# EAGLE design SO2Rduino-V1 (EAGLE 5.10)

## Sheet 1 of 2
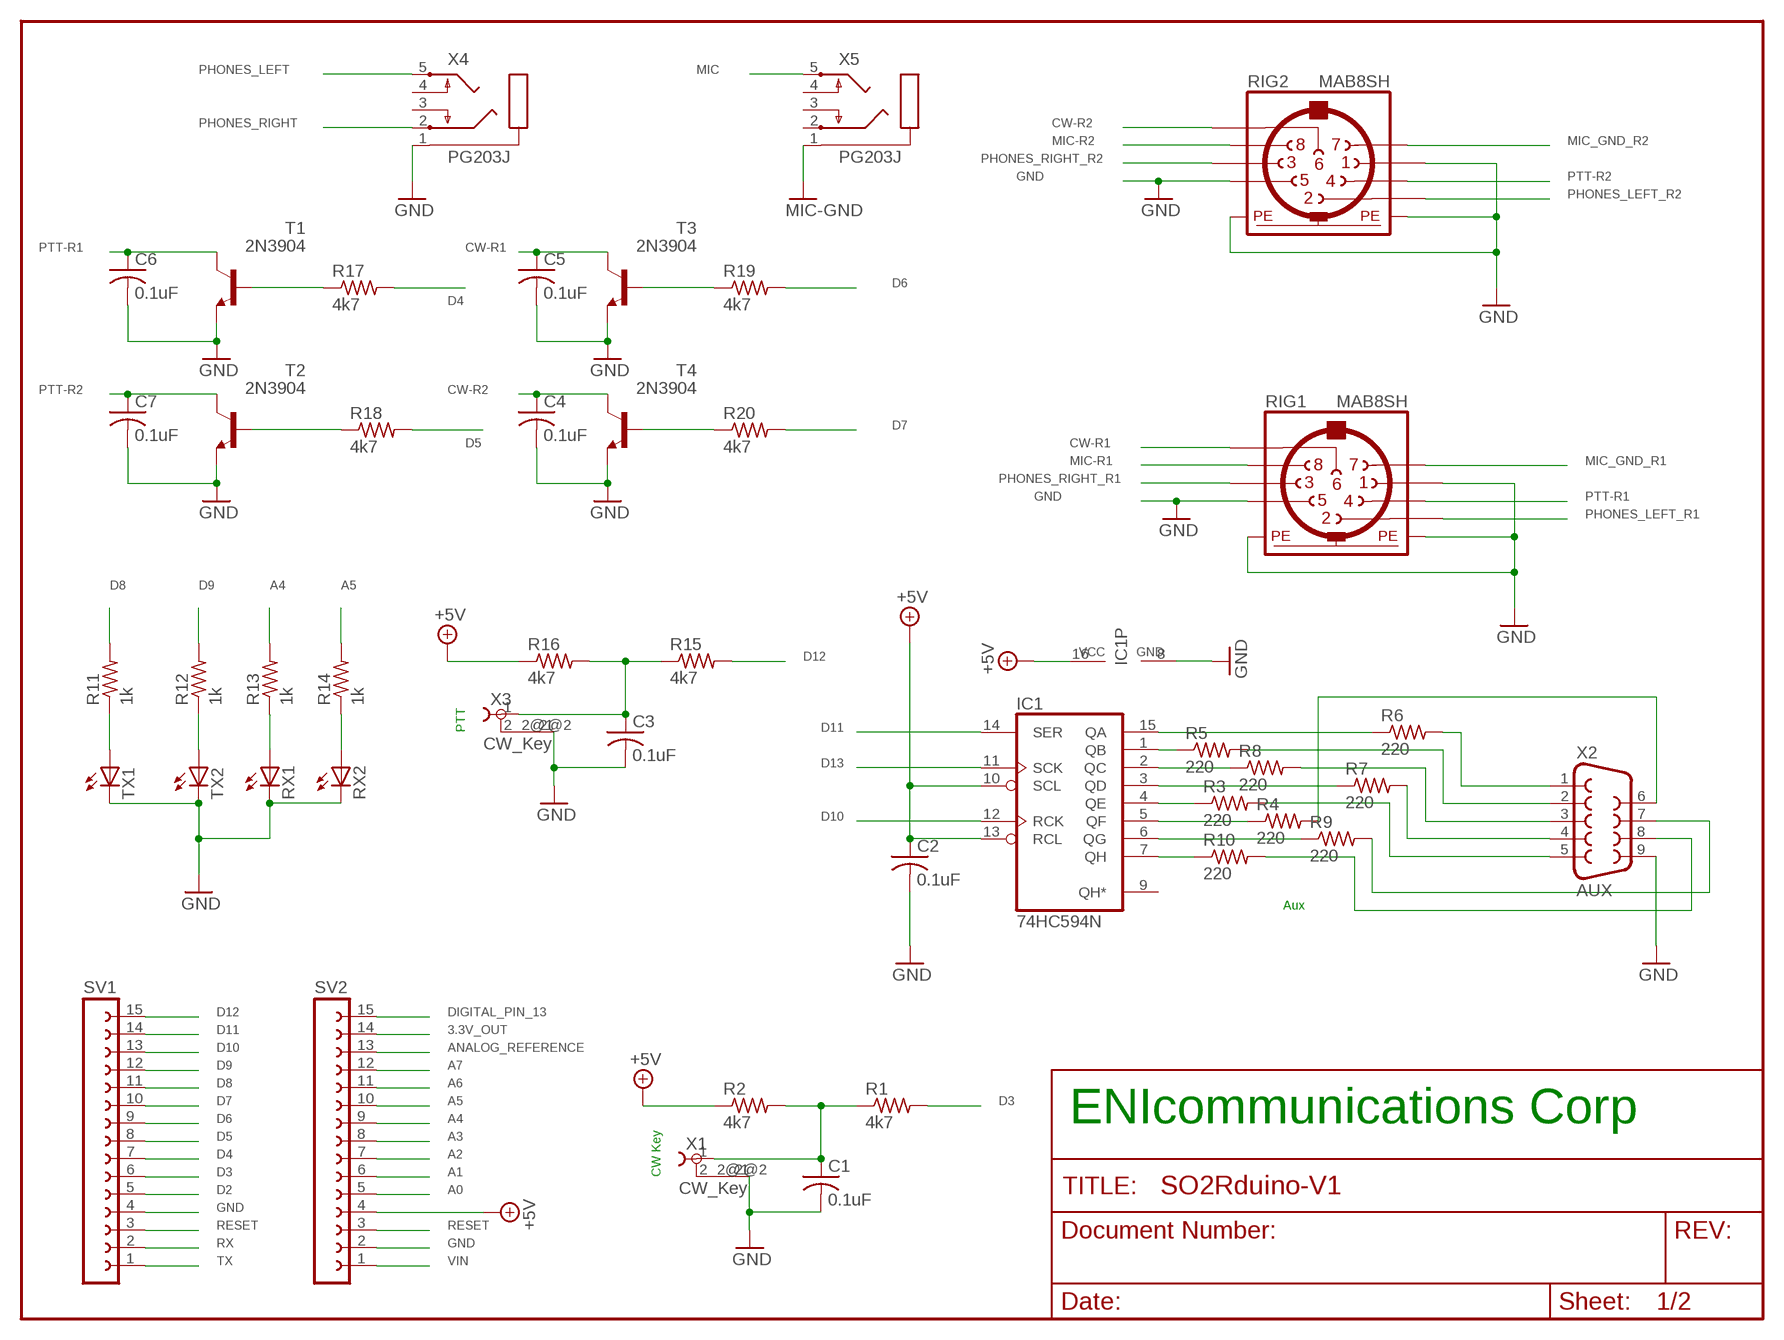
[diagram p0: schematic, sheet 1]

### Parts
C1  0.1uF  C-US025-025X050  [C025-025X050]
C2  0.1uF  C-US025-025X050  [C025-025X050]
C3  0.1uF  C-US025-025X050  [C025-025X050]
C4  0.1uF  C-US025-025X050  [C025-025X050]
C5  0.1uF  C-US025-025X050  [C025-025X050]
C6  0.1uF  C-US025-025X050  [C025-025X050]
C7  0.1uF  C-US025-025X050  [C025-025X050]
IC1  74HC594N  [DIL16]
R1  4k7  R-US_0204/7  [0204/7]
R2  4k7  R-US_0204/7  [0204/7]
R3  220  R-US_0204/7  [0204/7]
R4  220  R-US_0204/7  [0204/7]
R5  220  R-US_0204/7  [0204/7]
R6  220  R-US_0204/7  [0204/7]
R7  220  R-US_0204/7  [0204/7]
R8  220  R-US_0204/7  [0204/7]
R9  220  R-US_0204/7  [0204/7]
R10  220  R-US_0204/7  [0204/7]
R11  1k  R-US_0204/7  [0204/7]
R12  1k  R-US_0204/7  [0204/7]
R13  1k  R-US_0204/7  [0204/7]
R14  1k  R-US_0204/7  [0204/7]
R15  4k7  R-US_0204/7  [0204/7]
R16  4k7  R-US_0204/7  [0204/7]
R17  4k7  R-US_0204/7  [0204/7]
R18  4k7  R-US_0204/7  [0204/7]
R19  4k7  R-US_0204/7  [0204/7]
R20  4k7  R-US_0204/7  [0204/7]
RIG1  MAB8SH  [MAB8SH]
RIG2  MAB8SH  [MAB8SH]
RX1  LED5MM  [LED5MM]
RX2  LED5MM  [LED5MM]
SV1  FE15-1  [FE15]
SV2  FE15-1  [FE15]
T1  2N3904  [TO92]
T2  2N3904  [TO92]
T3  2N3904  [TO92]
T4  2N3904  [TO92]
TX1  LED5MM  [LED5MM]
TX2  LED5MM  [LED5MM]
X1  CW_Key  TOBU3  [TOBU3]
X2  AUX  DB9  [DB9]
X3  CW_Key  TOBU3  [TOBU3]
X4  PG203J  [PG203J]
X5  PG203J  [PG203J]

### Nets
3.3V_OUT: SV2.14
+5V: C2.1 IC1.10(SCL) IC1.13(RCL) IC1.16(VCC) R2.1 R16.1 SV2.4 ; also sheet 2
A0: SV2.5 ; also sheet 2
A1: SV2.6 ; also sheet 2
A2: SV2.7 ; also sheet 2
A3: SV2.8 ; also sheet 2
A4: R13.2 SV2.9
A5: R14.2 SV2.10
A6: SV2.11
A7: SV2.12
ANALOG_REFERENCE: SV2.13
CW-R1: C5.1 RIG1.6 T3.1(C)
CW-R2: C4.1 RIG2.6 T4.1(C)
D2: SV1.5
D3: R1.2 SV1.6
D4: R17.2 SV1.7
D5: R18.2 SV1.8
D6: R19.2 SV1.9
D7: R20.2 SV1.10
D8: R11.2 SV1.11
D9: R12.2 SV1.12 ; also sheet 2
D10: IC1.12(RCK) SV1.13
D11: IC1.14(SER) SV1.14 ; also sheet 2
D12: R15.2 SV1.15
D13: IC1.11(SCK) ; also sheet 2
DIGITAL_PIN_13: SV2.15
GND: C1.2 C2.2 C3.2 C4.2 C5.2 C6.2 C7.2 IC1.8(GND) RIG1.1 RIG1.5 RIG1.PE RIG1.PE@(PE) RIG2.1 RIG2.5 RIG2.PE RIG2.PE@(PE) RX1.K(C) RX2.K(C) SV1.4 SV2.2 T1.3(E) T2.3(E) T3.3(E) T4.3(E) TX1.K(C) TX2.K(C) X1.2@2 X2.9 X3.2@2 X4.1 ; also sheet 2
MIC: X5.5 ; also sheet 2
MIC-GND: X5.1 ; also sheet 2
MIC-R1: RIG1.8 ; also sheet 2
MIC-R2: RIG2.8 ; also sheet 2
MIC_GND_R1: RIG1.7 ; also sheet 2
MIC_GND_R2: RIG2.7 ; also sheet 2
N$1: C1.1 R1.1 R2.2 X1.1
N$2: IC1.4(QE) R3.1
N$3: R3.2 X2.5
N$4: IC1.3(QD) R7.1
N$5: R7.2 X2.4
N$6: IC1.2(QC) R8.1
N$7: R8.2 X2.3
N$8: IC1.1(QB) R5.1
N$9: R5.2 X2.2
N$10: IC1.15(QA) R6.1
N$11: R6.2 X2.1
N$12: IC1.5(QF) R4.1
N$13: R4.2 X2.6
N$14: IC1.6(QG) R9.1
N$15: IC1.7(QH) R10.1
N$16: R9.2 X2.7
N$17: R10.2 X2.8
N$18: R12.1 TX2.A
N$19: R11.1 TX1.A
N$20: C3.1 R15.1 R16.2 X3.1
N$21: R13.1 RX1.A
N$22: R14.1 RX2.A
N$23: R17.1 T1.2(B)
N$24: R18.1 T2.2(B)
N$25: R19.1 T3.2(B)
N$26: R20.1 T4.2(B)
PHONES_LEFT: X4.5 ; also sheet 2
PHONES_LEFT_R1: RIG1.2 ; also sheet 2
PHONES_LEFT_R2: RIG2.2 ; also sheet 2
PHONES_RIGHT: X4.2 ; also sheet 2
PHONES_RIGHT_R1: RIG1.3 ; also sheet 2
PHONES_RIGHT_R2: RIG2.3 ; also sheet 2
PTT-R1: C6.1 RIG1.4 T1.1(C)
PTT-R2: C7.1 RIG2.4 T2.1(C)
RESET: SV1.3 SV2.3
RX: SV1.2
TX: SV1.1
VIN: SV2.1
Unconnected: IC1.9(QH*) X1.2 X1.2@1 X3.2 X3.2@1 X4.3 X4.4 X5.2 X5.3 X5.4

### Notes on the sheet
- PTT
- Aux
- ENIcommunications Corp
- CW Key

## Sheet 2 of 2
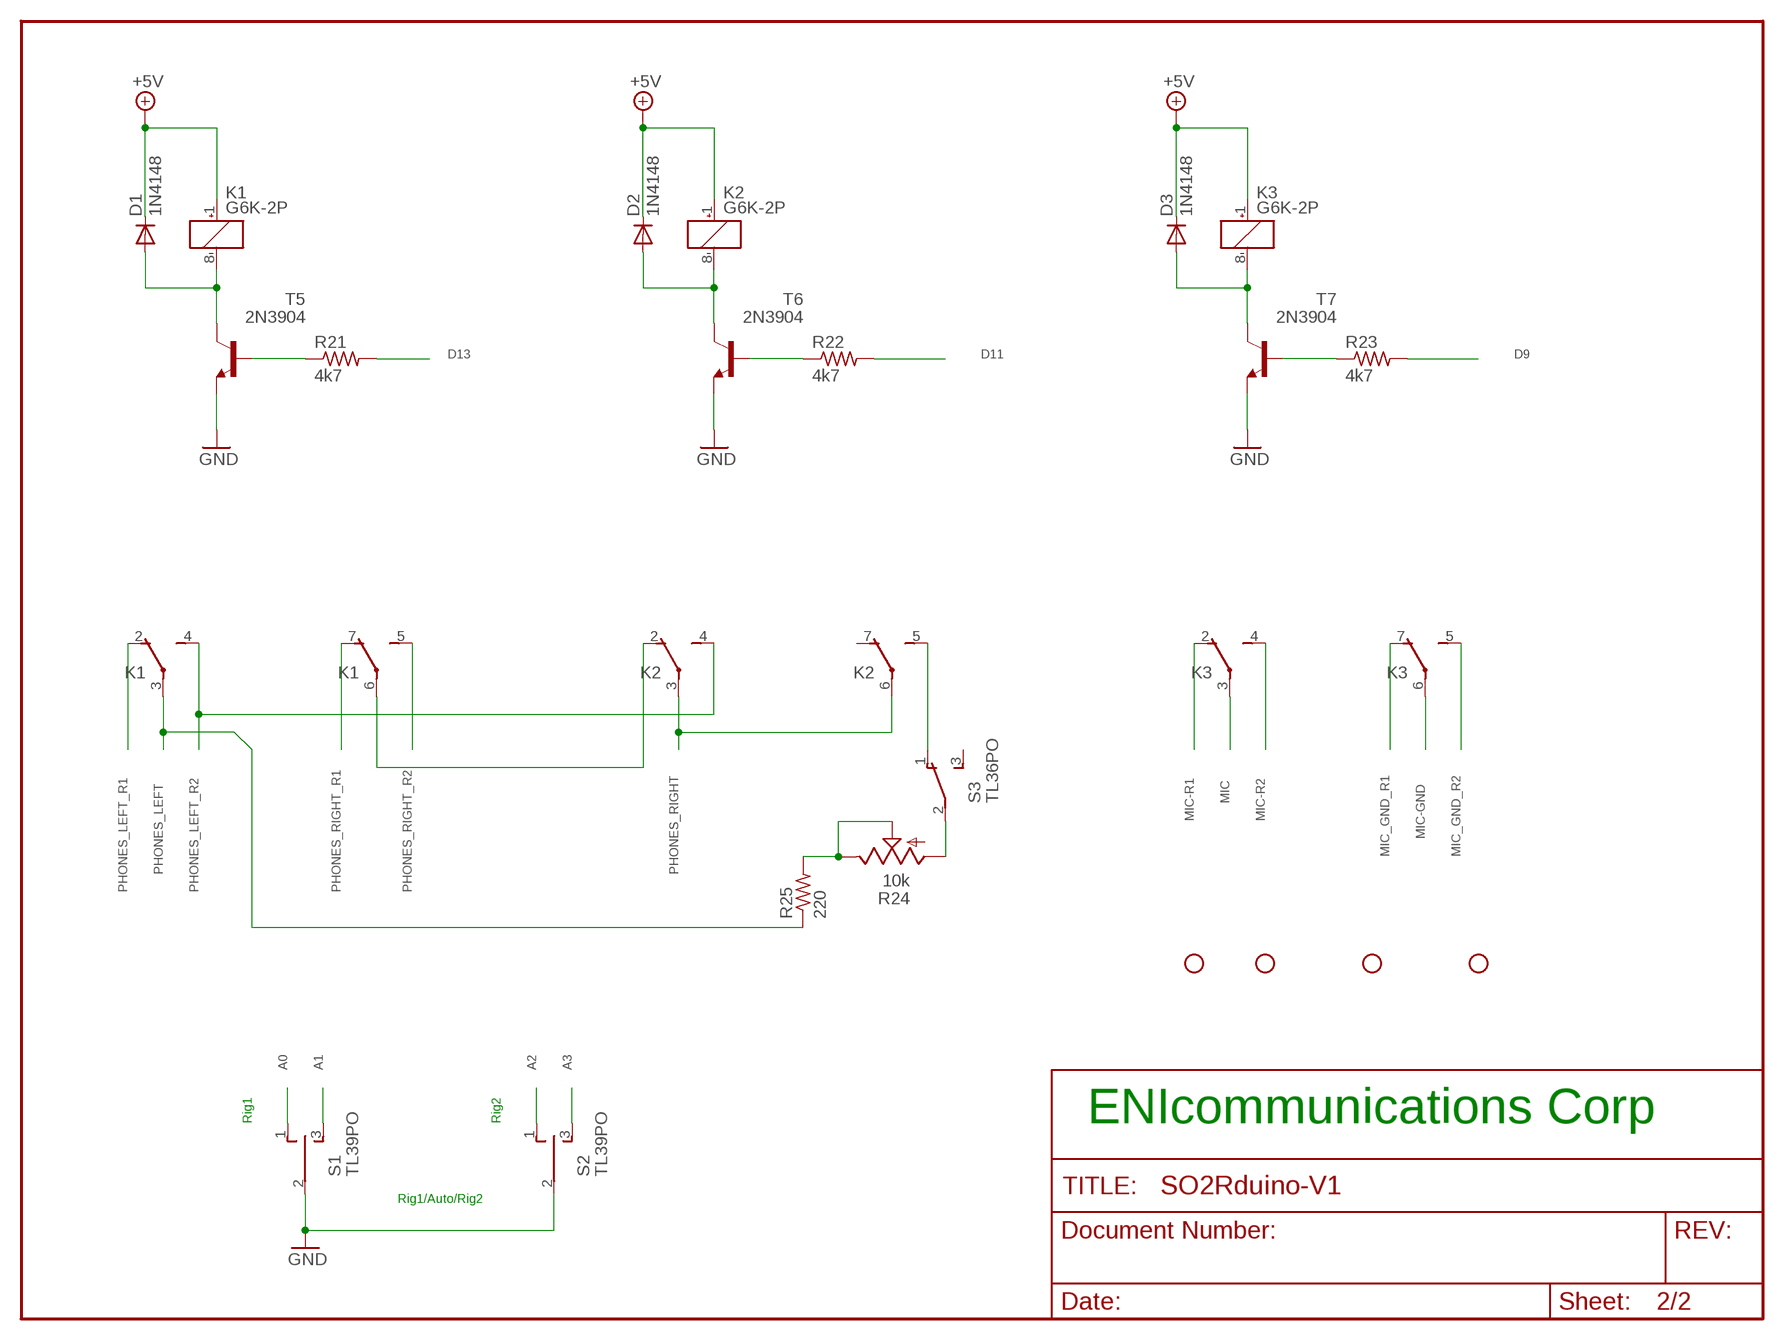
[diagram p1: schematic, sheet 2]

### Parts
D1  1N4148  [DO35-10]
D2  1N4148  [DO35-10]
D3  1N4148  [DO35-10]
JP1  STAND-OFF  [STAND-OFF]
JP2  STAND-OFF  [STAND-OFF]
JP3  STAND-OFF  [STAND-OFF]
JP6  STAND-OFF  [STAND-OFF]
K1  G6K-2P  [G6K-2P]
K2  G6K-2P  [G6K-2P]
K3  G6K-2P  [G6K-2P]
R21  4k7  R-US_0204/7  [0204/7]
R22  4k7  R-US_0204/7  [0204/7]
R23  4k7  R-US_0204/7  [0204/7]
R24  10k  TRIM_US-CA6V  [CA6V]
R25  220  R-US_0204/7  [0204/7]
S1  TL39PO  [TL3XPO]
S2  TL39PO  [TL3XPO]
S3  TL36PO  [TL3XPO]
T5  2N3904  [TO92]
T6  2N3904  [TO92]
T7  2N3904  [TO92]

### Nets
+5V: D1.C D2.C D3.C K1.1(1:+) K2.1(1:+) K3.1(1:+) ; also sheet 1
A0: S1.1(O) ; also sheet 1
A1: S1.3(S) ; also sheet 1
A2: S2.1(O) ; also sheet 1
A3: S2.3(S) ; also sheet 1
D9: R23.2 ; also sheet 1
D11: R22.2 ; also sheet 1
D13: R21.2 ; also sheet 1
GND: S1.2(P) S2.2(P) T5.3(E) T6.3(E) T7.3(E) ; also sheet 1
MIC: K3.3(2:P) ; also sheet 1
MIC-GND: K3.6(3:P) ; also sheet 1
MIC-R1: K3.2(2:O) ; also sheet 1
MIC-R2: K3.4(2:S) ; also sheet 1
MIC_GND_R1: K3.7(3:O) ; also sheet 1
MIC_GND_R2: K3.5(3:S) ; also sheet 1
N$27: D2.A K2.8(1:-) T6.1(C)
N$28: D3.A K3.8(1:-) T7.1(C)
N$29: K2.5(3:S) S3.1(O)
N$30: R24.A S3.2(P)
N$31: R22.1 T6.2(B)
N$32: D1.A K1.8(1:-) T5.1(C)
N$33: R21.1 T5.2(B)
N$34: R23.1 T7.2(B)
N$37: R24.E R24.S R25.2
N$40: K1.6(3:P) K2.2(2:O)
PHONES_LEFT: K1.3(2:P) R25.1 ; also sheet 1
PHONES_LEFT_R1: K1.2(2:O) ; also sheet 1
PHONES_LEFT_R2: K1.4(2:S) K2.4(2:S) ; also sheet 1
PHONES_RIGHT: K2.3(2:P) K2.6(3:P) ; also sheet 1
PHONES_RIGHT_R1: K1.7(3:O) ; also sheet 1
PHONES_RIGHT_R2: K1.5(3:S) ; also sheet 1
Unconnected: K2.7(3:O) S3.3(S)

### Notes on the sheet
- Rig1 | Rig2 | ENIcommunications Corp
- Rig1/Auto/Rig2

## Library data of the parts
C1-C7 = rcl:C-US: CAPACITOR, American symbol
D1-D3 = diode:1N4148: DIODE high speed (Philips)
IC1 = 74xx-eu:74*594: 8-bit SHIFT REGISTER, output latch
JP1-JP3 JP6 = SparkFun:STAND-OFF: Stand Off This is the mechanical footprint for a #4 phillips button head screw. Use the keepout ring to avoid running the screw head into surrounding components. SKU : PRT-00447
K1-K3 = relay:G6K: Low Signal Relay oeiwcsnts1.omron.com/.. D20G6K0100.pdf
R1-R23 R25 = resistor:R-US_: RESISTOR, American symbol
R24 = pot:TRIM_US-: POTENTIOMETER
RIG1 RIG2 = con-hirschmann:MAB8SH: Female CONNECTOR 8 pins with shield, horizontal (DIN 41524)
RX1 RX2 TX1 TX2 = led:LED: LED OSRAM: - CHIPLED LG R971, LG N971, LY N971, LG Q971, LY Q971, LO R971, LY R971 LH N974, LH R974 LS Q976, LO Q976, LY Q976 LO Q996 - Hyper CHIPLED LW Q18S LB Q993, LB Q99A, LB R99A - SideLED LS A670, LO A670, LY A670, LG A670, LP A670 LB A673, LV A673, LT A673, LW A673 LH A674 LY A675 LS A676, LA A676, LO A676, LY A676, LW A676 LS A679, LY A679, LG A679 - Hyper Micro SIDELED® LS Y876, LA Y876, LO Y876, LY Y876 LT Y87S - SmartLED LW L88C, LW L88S LB L89C, LB L89S, LG L890 LS L89K, LO L89K, LY L89K LS L896, LA L896, LO L896, LY L896 - TOPLED LS T670, LO T670, LY T670, LG T670, LP T670 LSG T670, LSP T670, LSY T670, LOP T670, LYG T670 LG T671, LOG T671, LSG T671 LB T673, LV T673, LT T673, LW T673 LH T674 LS T676, LA T676, LO T676, LY T676, LB T676, LH T676, LSB T676, LW T676 LB T67C, LV T67C, LT T67C, LS T67K, LO T67K, LY T67K, LW E67C LS E67B, LA E67B, LO E67B, LY E67B, LB E67C, LV E67C, LT E67C LW T67C LS T679, LY T679, LG T679 LS T770, LO T770, LY T770, LG T770, LP T770 LB T773, LV T773, LT T773, LW T773 LH T774 LS E675, LA E675, LY E675, LS T675 LS T776, LA T776, LO T776, LY T776, LB T776 LHGB T686 LT T68C, LB T68C - Hyper Mini TOPLED® LB M676 - Mini TOPLED Santana® LG M470 LS M47K, LO M47K, LY M47K Source: http://www.osram.convergy.de/
S1 S2 = switch:TL39PO: TINY SWITCH ON OFF ON Source: http://www2.produktinfo.conrad.com/datenblaetter/700000-724999/705152-da-01-de-Subminiaturschalter_TL_36YO.pdf
S3 = switch:TL36PO: TINY SWITCH ON - ON Source: http://www2.produktinfo.conrad.com/datenblaetter/700000-724999/705152-da-01-de-Subminiaturschalter_TL_36YO.pdf
SV1 SV2 = con-lsta:FE15-1: FEMALE HEADER
T1-T7 = transistor:2N3904: NPN TRANSISTOR
X1 X3 = con-hirschmann:TOBU3: Female Cinch CONNECTOR ( RCA Jack )
X2 = SparkFun:DB9: DB9 Connector Standard DB9 (D-Sub 9) serial connector. Can be used for CAN bus as well as RS485 and RS232. Footprint production proven. Spark Fun Electronics SKU : PRT-00429
X4 X5 = con-hirschmann:PG203J: MIC/HEADPHONE JACK KS-S stereo microphone/headphone jack PG203JN (Schukat)

## Board
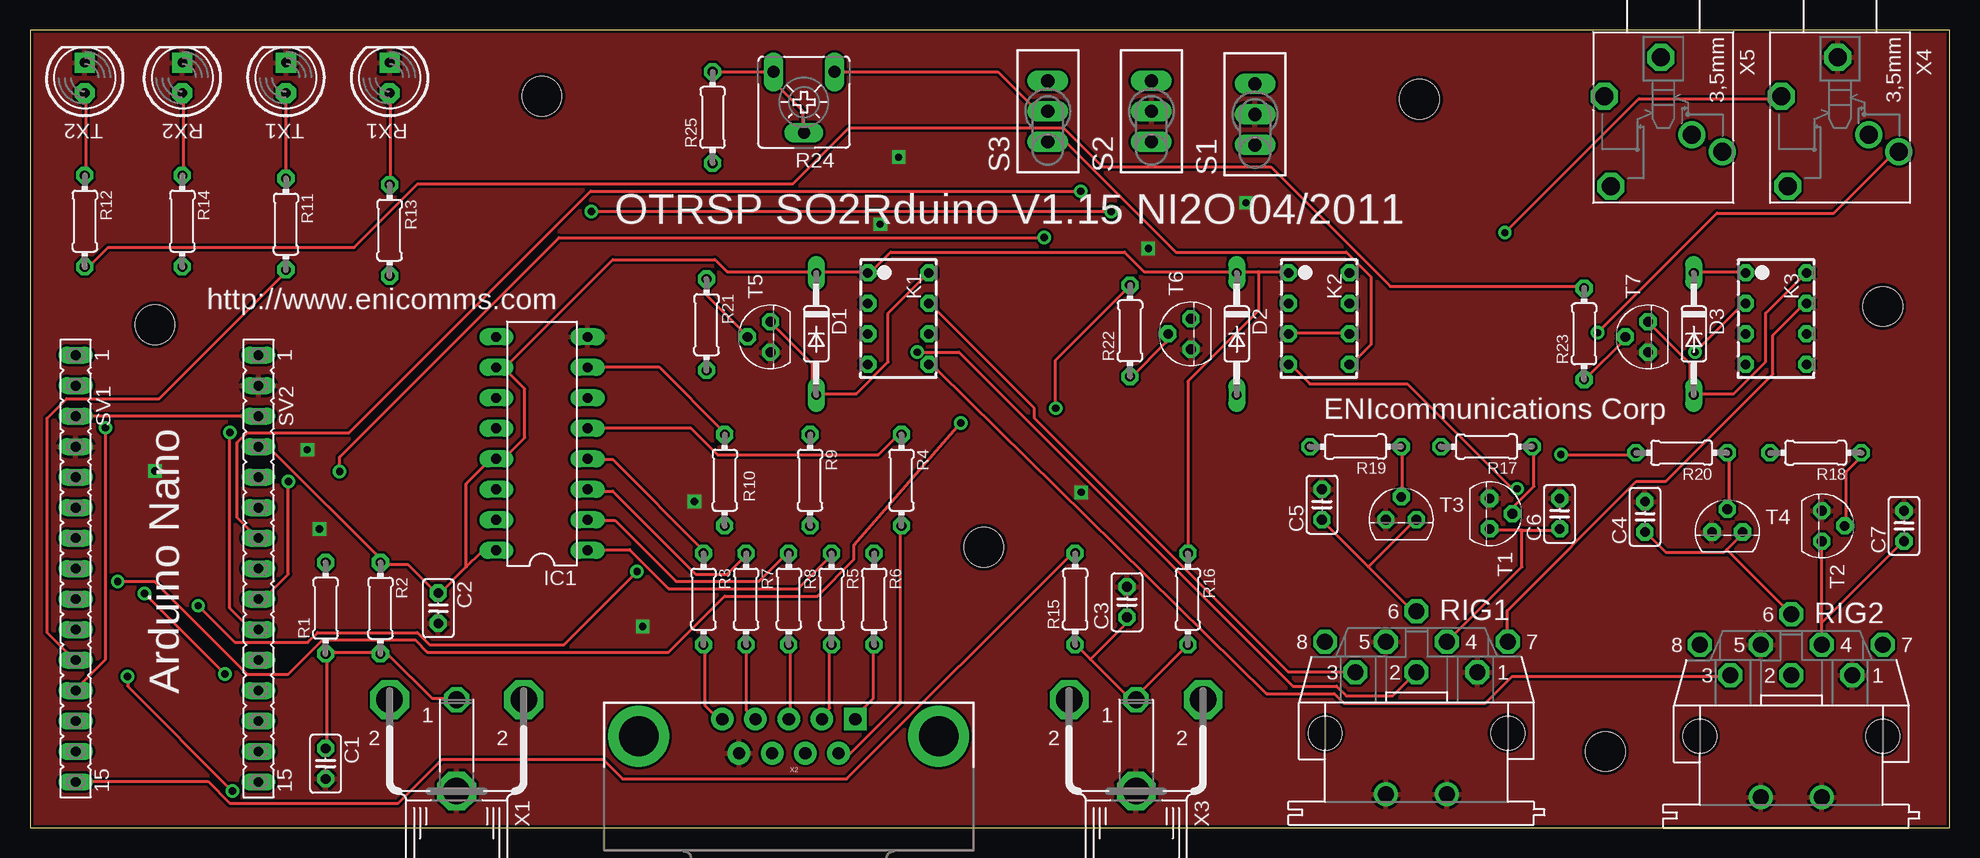
[diagram p2: board, top side]
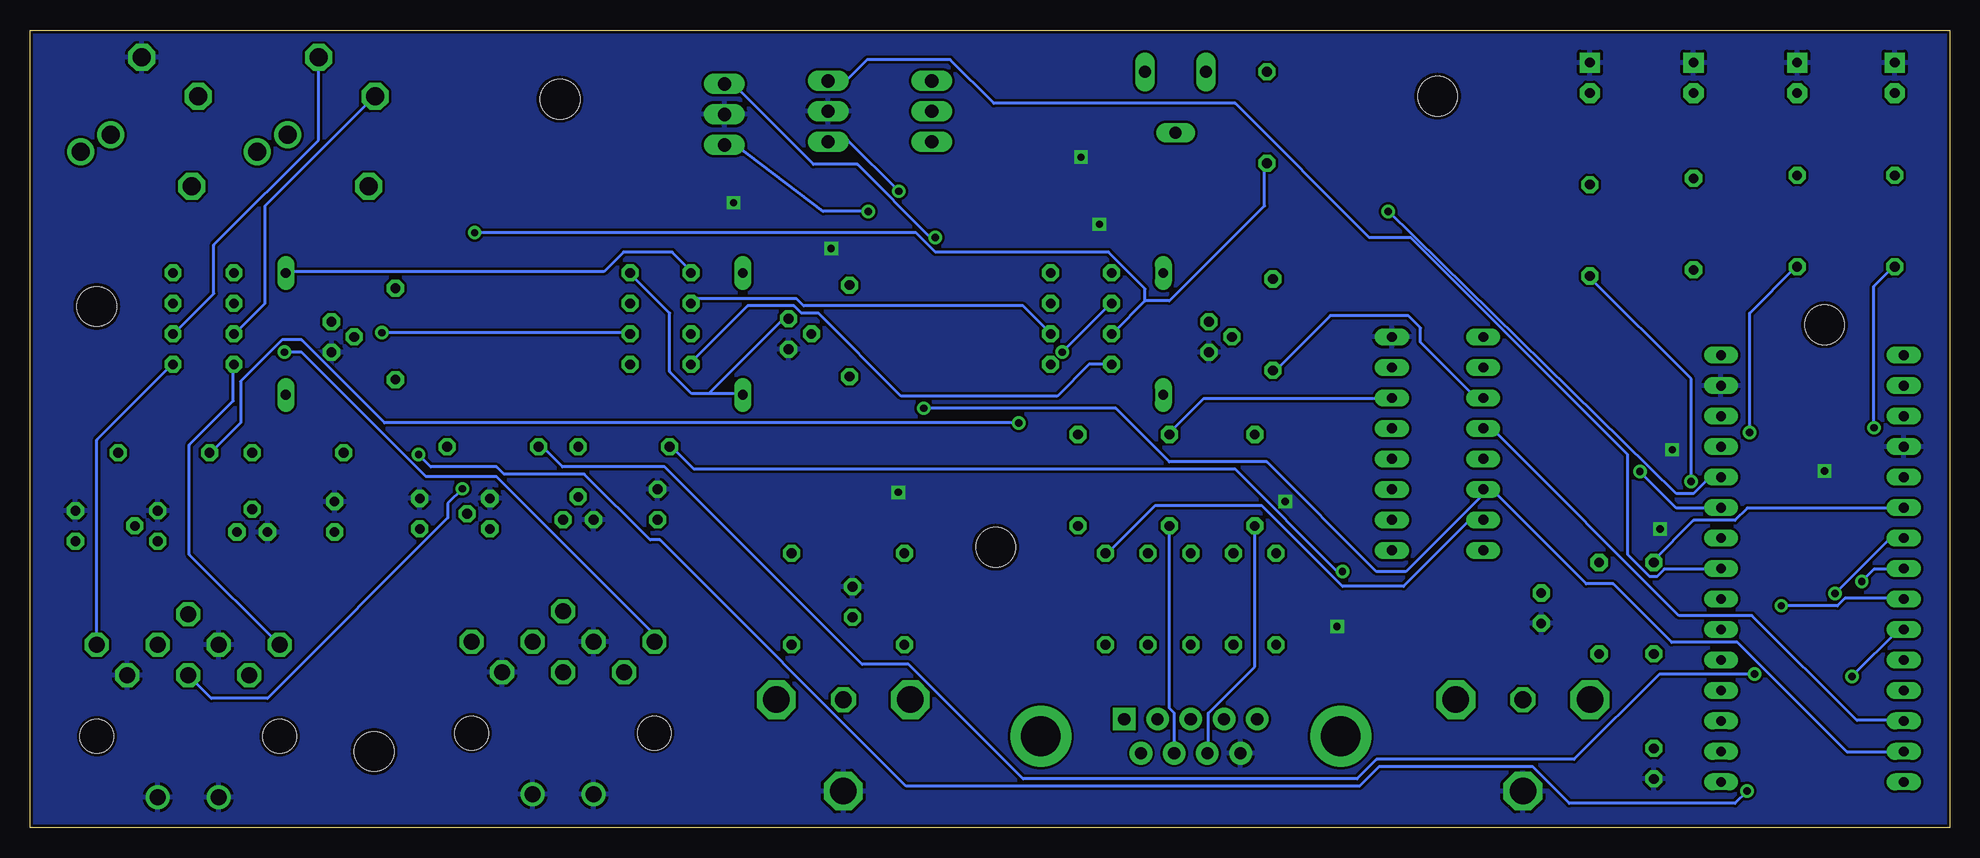
[diagram p3: board, bottom side, seen from below]

Size 160 x 66.47 mm. Coordinates in mm from the lower left corner, seen from the top.
Outline: 0,0 160,0 160,66.47 0,66.47 0,0
Copper layers (1*16): Top 0.035mm / dielectric 1.5mm / Bottom 0.035mm
Design rules "SparkFun": minimum track width 8mil, minimum drill 20mil, track to track 8mil, track to pad 8mil, pad to pad 8mil, via to via 8mil, smd to smd 8mil, copper to edge 10mil, drill to drill 8mil, minimum pad ring 12mil, minimum via ring 10mil, stop-mask expansion 4mil, vias tented up to drill 25mil, thermal gap 10mil

### Footprints (pad centres in the part's own frame; a part is rotated, then mirrored left to right if it is on the bottom)
C025-025X050 = drill 0.813 octagon: 1 -1.27,0; 2 1.27,0
DO35-10 = drill 0.813 long: A 5.08,0; C -5.08,0
DIL16 = drill 0.813 long: 1 -8.89,-3.81; 2 -6.35,-3.81; 3 -3.81,-3.81; 4 -1.27,-3.81; 5 1.27,-3.81; 6 3.81,-3.81; 7 6.35,-3.81; 8 8.89,-3.81; 9 8.89,3.81; 10 6.35,3.81; 11 3.81,3.81; 12 1.27,3.81; 13 -1.27,3.81; 14 -3.81,3.81; 15 -6.35,3.81; 16 -8.89,3.81
STAND-OFF = hole 3.302: 0,0
G6K-2P = drill 0.8 octagon: 1 -2.54,-2.54; 2 0,-2.54; 3 2.54,-2.54; 4 5.08,-2.54; 5 5.08,2.54; 6 2.54,2.54; 7 0,2.54; 8 -2.54,2.54
0204/7 = drill 0.813 octagon: 1 -3.81,0; 2 3.81,0
CA6V = drill 1.016 long: A -2.54,-2.54; E 2.54,-2.54; S 0,2.54
MAB8SH = drill 1.321 octagon: 1 5.08,5.08; 2 0,5.08; 3 -5.08,5.08; 4 2.54,7.62; 5 -2.54,7.62; 6 0,10.16; 7 7.62,7.62; 8 -7.62,7.62 | drill 1.321 round: PE -2.54,-5.08; PE@ 2.54,-5.08 | hole 2.794: -7.62,0; 7.62,0
LED5MM = drill 0.813 pad 1.676 octagon: A -1.27,0 | drill 0.813 pad 1.676 square: K 1.27,0
TL3XPO = drill 1.1 pad 1.422 long: 1 -2.54,0; 2 0,0; 3 2.54,0
FE15 = drill 0.813 long: 1 -17.78,0; 2 -15.24,0; 3 -12.7,0; 4 -10.16,0; 5 -7.62,0; 6 -5.08,0; 7 -2.54,0; 8 0,0; 9 2.54,0; 10 5.08,0; 11 7.62,0; 12 10.16,0; 13 12.7,0; 14 15.24,0; 15 17.78,0
TO92 = drill 0.813 octagon: 1 1.27,0; 2 0,1.905; 3 -1.27,0
TOBU3 = drill 1.397 octagon: 1 0,-2.54 | drill 2.21 octagon: 2 5.588,-2.54; 2@1 -5.588,-2.54; 2@2 0,5.08
DB9 = drill 1.016 pad 1.88 square: 1 -5.54,-1.42 | drill 1.016 pad 1.88 round: 2 -2.77,-1.42; 3 0,-1.42; 4 2.77,-1.42; 5 5.54,-1.42; 6 -4.15,1.42; 7 -1.38,1.42; 8 1.38,1.42; 9 4.15,1.42 | drill 3.302 pad 5.08 round: G1 -12.5,0; G2 12.5,0
PG203J = drill 1.499 octagon: 1 -5.004,-0.203; 4 5.74,-4.369; 5 -1.753,-4.902 | drill 1.499 round: 2 2.845,4.902; 3 1.448,2.388

### Placement (x,y rotation side)
C1  24.64,5.33 270 top
C2  34.04,18.29 270 top
C3  91.44,18.8 90 top
C4  134.62,25.91 90 top
C5  107.7,26.92 90 top
C6  127.51,26.16 90 top
C7  156.21,25.15 90 top
D1  65.53,41.15 270 top
D2  100.58,41.15 270 top
D3  138.68,41.15 270 top
IC1  42.67,32 90 top
JP1  42.67,60.96 0 top
JP2  115.82,60.71 0 top
JP3  131.32,6.35 0 top
JP4  STAND-OFF  [STAND-OFF]  10.41,41.91 0 top
JP5  STAND-OFF  [STAND-OFF]  79.5,23.37 0 top
JP6  154.43,43.43 0 top
K1  72.39,43.69 270 top
K2  107.44,43.69 270 top
K3  145.54,43.69 270 top
R1  24.64,18.29 90 top
R2  29.21,18.29 270 top
R3  56.13,19.05 270 top
R4  72.64,28.96 270 top
R5  66.8,19.05 270 top
R6  70.36,19.05 270 top
R7  59.69,19.05 270 top
R8  63.25,19.05 270 top
R9  65.02,28.96 270 top
R10  57.91,28.96 270 top
R11  21.34,50.29 270 top
R12  4.57,50.55 270 top
R13  29.97,49.78 270 top
R14  12.7,50.55 270 top
R15  87.12,19.05 90 top
R16  96.52,19.05 270 top
R17  121.41,31.75 180 top
R18  148.84,31.24 180 top
R19  110.49,31.75 180 top
R20  137.67,31.24 180 top
R21  56.39,41.91 270 top
R22  91.69,41.4 90 top
R23  129.54,41.15 90 top
R24  64.52,60.45 180 top
R25  56.9,59.18 90 top
RIG1  115.57,7.87 0 top
RIG2  146.81,7.62 0 top
RX1  29.97,62.48 90 top
RX2  12.7,62.48 90 top
S1  102.11,59.44 90 top
S2  93.47,59.69 90 top
S3  84.84,59.69 90 top
SV1  3.81,21.59 270 top
SV2  19.05,21.59 270 top
T1  121.67,26.16 270 top
T2  149.35,25.15 270 top
T3  114.3,25.65 0 top
T4  141.48,24.64 0 top
T5  61.72,40.89 90 top
T6  96.77,41.15 90 top
T7  134.87,40.89 90 top
TX1  21.34,62.48 90 top
TX2  4.57,62.48 90 top
X1  35.56,8.13 180 top
X2  63.25,7.62 180 top
X3  92.2,8.13 180 top
X4  150.88,59.18 270 top
X5  136.14,59.18 270 top

### Tracks (layer width: path | path; a pad name or v marks a point on that pad's centre or on a via)
+5V
  Top 0.254: K3.1 142.85,46.33 138.79,46.33 D3.C | 100.58,46.33 102.41,46.33 | 102.41,46.33 104.85,46.33 K2.1 | 102.41,46.33 102.41,43.08 96.52,37.19 R16.1 | 29.67,21.95 31.5,21.95 33.93,19.51 C2.1 34.14,19.51 36.37,21.74 | 29.67,21.95 29.26,21.95 R2.1 29.67,21.95 | 36.37,21.74 37.59,22.96 38.81,22.96 IC1.16 | 36.37,21.74 36.37,28.65 38.41,30.68 38.81,30.68 IC1.13 39.01,30.89 39.62,30.89 41.25,32.51 41.25,36.58 39.62,38.2 39.42,38.2 | 29.67,21.95 19.91,31.7 19.1,31.7 SV2.4 | 39.42,38.2 39.01,38.2 IC1.10 39.42,38.2 | 39.42,38.2 48.56,47.35 57.1,47.35 58.12,46.33 65.43,46.33 D1.C 65.63,46.33 69.7,46.33 K1.1 69.9,46.13 71.73,47.95 91.24,47.95 92.86,46.33 100.58,46.33 | 100.58,46.33 D2.C
  Bottom 0.254: D3.C 138.58,46.33 112.17,46.33 110.54,47.95 106.48,47.95 104.85,46.33 K2.1
A0  (via drill 0.61)
  Top 0.254: v46.79,51.36 v90.12,51.36
  Bottom 0.254: v46.79,51.36 22.76,27.84 21.34,27.84 20.12,29.06 19.1,29.06 SV2.5 | v90.12,51.36 93.88,51.36 101.19,56.9 S1.1
A1  (via drill 0.61)
  Top 0.254: v25.81,29.67 25.81,30.89 44.09,49.17 v84.53,49.17
  Bottom 0.254: v25.81,29.67 22.76,26.62 19.1,26.62 SV2.6 | v84.53,49.17 84.94,49.17 91.03,55.27 94.69,55.27 101.4,61.98 S1.3
A2  (via drill 0.61)
  Top 0.254: v87.58,53.03 46.74,53.03 26.62,32.92 18.09,32.92 17.27,32.11 17.27,25.81 18.9,24.18 SV2.7
  Bottom 0.254: v87.58,53.03 91.85,57.3 93.47,57.3 S2.1
A3
  Bottom 0.254: SV2.8 19.1,21.54 23.77,21.54 24.38,20.93 24.99,20.93 26.82,22.76 26.82,31.09 44.91,49.17 48.36,49.17 59.54,60.35 79.65,60.35 83.31,64.01 90.22,64.01 91.85,62.38 93.47,62.38 S2.3
A4  (via drill 0.61)
  Top 0.254: v21.54,28.85 21.54,21.13 19.51,19.1 19.1,19.1 SV2.9
  Bottom 0.254: v21.54,28.85 21.54,37.39 30.07,45.92 R13.2
A5  (via drill 0.61)
  Top 0.254: v16.66,32.92 16.66,18.29 18.29,16.66 18.9,16.66 SV2.10
  Bottom 0.254: v16.66,32.92 16.66,42.88 12.8,46.74 R14.2
CW-R1
  Top 0.254: 111.56,21.74 115.42,17.88 RIG1.6 | 111.56,21.74 107.7,25.6 C5.1 | 111.56,21.74 115.42,25.6 T3.1
CW-R2
  Top 0.254: 141.43,23.16 142.85,24.59 T4.1 | 141.43,23.16 141.22,22.96 136.35,22.96 134.72,24.59 C4.1 | 141.43,23.16 RIG2.6
D3
  Bottom 0.254: SV1.6 3.86,26.62 16.87,26.62 17.88,25.6 21.34,25.6 24.79,22.15 R1.2
D4  (via drill 0.61)
  Top 0.254: v9.55,19.51 v16.26,12.8
  Bottom 0.254: v9.55,19.51 5.08,23.98 3.86,23.98 SV1.7 | v16.26,12.8 24.18,12.8 31.29,5.69 47.75,5.69 49.38,4.06 77.22,4.06 86.77,13.61 90.63,13.61 107.09,30.07 115.62,30.07 117.45,31.9 R17.2
D5  (via drill 0.61)
  Top 0.254: v7.32,20.52 10.36,20.52 18.09,12.8 21.54,12.8 24.38,15.65 32.11,15.65 33.12,14.63 53.24,14.63 57.91,19.3 65.63,19.3 68.68,22.35 68.68,23.57 v77.57,33.73
  Bottom 0.254: v7.32,20.52 6.3,21.54 3.86,21.54 SV1.8 | v77.57,33.73 130.45,33.73 137.36,40.64 138.99,40.64 142.44,37.19 142.44,33.73 144.88,31.29 R18.2
D6  (via drill 0.61)
  Top 0.254: v14.02,18.49 17.07,15.44 23.16,15.44 23.98,16.26 32.31,16.26 33.33,15.24 44.5,15.24 v50.6,21.34
  Bottom 0.254: v14.02,18.49 9.35,18.49 8.74,19.1 3.86,19.1 SV1.9 | v50.6,21.34 51,21.34 59.54,29.87 104.65,29.87 106.68,31.9 R19.2
D7  (via drill 0.61)
  Top 0.254: v8.13,12.6 8.13,11.79 v16.87,3.05 | v127.61,31.09 133.71,31.09 R20.2
  Bottom 0.254: v8.13,12.6 4.27,16.46 3.86,16.46 SV1.10 | v16.87,3.05 17.88,2.03 31.7,2.03 34.75,5.08 47.55,5.08 49.17,3.45 86.97,3.45 107.49,23.98 108.31,23.98 113.79,29.46 120.5,29.46 121.11,30.07 126.59,30.07 v127.61,31.09
D8
  Top 0.254: SV1.11 3.66,14.02 1.42,16.26 1.42,34.14 3.05,35.76 10.77,35.76 21.34,46.33 R11.2
D9  (via drill 0.61)
  Top 0.254: v6.3,33.33 6.3,14.02 3.86,11.58 SV1.12 | R23.2 129.44,45.11 113.39,45.11 103.43,55.07 89.41,55.07 86.16,58.32 68.28,58.32 63.6,53.65 32.31,53.65 27.03,48.36 6.5,48.36 4.88,46.74 R12.2
  Bottom 0.254: v6.3,33.33 6.3,45.11 4.67,46.74 R12.2
D10
  Bottom 0.254: SV1.13 3.86,8.94 7.72,8.94 16.46,17.68 22.55,17.68 38,33.12 38.81,33.12 IC1.12
D11  (via drill 0.61)
  Top 0.254: v85.5,34.95 85.5,38.96 91.64,45.11 R22.2
  Bottom 0.254: 38.61,28.04 38.81,28.04 IC1.14 38.61,28.04 | 38.61,28.04 38,28.04 30.28,20.32 28.04,20.32 23.16,15.44 17.68,15.44 8.53,6.3 3.86,6.3 SV1.14 | v85.5,34.95 69.49,34.95 65.02,30.48 56.9,30.48 47.75,21.34 45.31,21.34 38.61,28.04
D12
  Top 0.254: SV1.15 3.86,3.86 14.83,3.86 16.66,2.03 30.68,2.03 34.34,5.69 47.75,5.69 49.38,4.06 68.07,4.06 86.97,22.96 R15.2
D13
  Bottom 0.254: IC1.11 39.01,35.97 39.62,35.97 44.09,40.44 44.09,41.66 45.11,42.67 51.61,42.67 56.29,38 R21.2
GND  (via drill 0.6)
  other vias: 10.41,29.72 23.11,31.5 24.13,24.89 51.05,16.76 72.39,55.88 101.35,52.07 93.22,48.26 70.87,50.29 87.63,27.94 55.37,27.18
  pour Bottom: 0,0 160.02,0 160.27,66.55 -0.25,66.29
  pour Top: 0,0 160.02,0 160.02,66.29 0,66.29
MIC
  Bottom 0.254: K3.3 142.85,41.25 140.41,43.69 140.41,51.82 131.27,60.96 X5.5
MIC-GND
  Bottom 0.254: K3.6 147.93,41.25 144.68,44.5 144.68,48.56 135.94,57.3 X5.1
MIC-R1  (via drill 0.61)
  Top 0.254: v138.79,39.62 142.85,43.69 K3.2
  Bottom 0.254: v138.79,39.62 137.36,39.62 127,29.26 121.11,29.26 108.1,16.26 108.1,15.65 RIG1.8
MIC-R2
  Bottom 0.254: RIG2.8 146.71,22.76 146.71,31.9 143.05,35.56 143.05,38.61 K3.4
MIC_GND_R1
  Top 0.254: K3.7 147.93,43.69 145.29,41.05 145.29,37.8 136.35,28.85 133.91,28.85 123.14,18.09 123.14,15.65 RIG1.7
MIC_GND_R2
  Bottom 0.254: RIG2.7 154.43,32.31 148.13,38.61 K3.5
N$1
  Top 0.254: C1.1 24.79,6.71 24.79,14.43 R1.1 24.79,14.63 29.06,14.63 R2.2 29.26,14.43 29.87,14.43 33.53,10.77 35.56,10.77 X1.1
N$2
  Top 0.254: IC1.4 46.53,30.68 48.56,30.68 56.29,22.96 R3.1
N$3
  Top 0.254: R3.2 56.29,15.24 56.29,10.16 57.51,8.94 X2.5
N$4
  Top 0.254: IC1.3 46.53,28.04 48.56,28.04 55.47,21.13 58.12,21.13 59.74,22.76 R7.1
N$5
  Top 0.254: R7.2 59.74,15.24 59.74,9.75 60.35,9.14 X2.4
N$6
  Top 0.254: IC1.2 46.53,25.6 48.77,25.6 53.85,20.52 60.76,20.52 63.2,22.96 R8.1
N$7
  Top 0.254: R8.2 63.4,15.24 63.4,9.14 X2.3
N$8
  Top 0.254: IC1.1 46.53,23.16 49.99,23.16 53.24,19.91 64.01,19.91 66.85,22.76 R5.1
N$9
  Top 0.254: R5.2 66.65,15.24 66.65,9.96 65.84,9.14 X2.2
N$10
  Bottom 0.254: IC1.15 39.01,25.6 40.03,25.6 45.52,20.12 50.6,20.12 57.3,26.82 66.24,26.82 70.31,22.76 R6.1
N$11
  Top 0.254: R6.2 70.31,15.24 70.31,10.77 68.68,9.14 X2.1
N$12
  Top 0.254: IC1.5 46.53,33.33 55.07,33.33 57.3,31.09 70.71,31.09 72.54,32.92 R4.1
N$13
  Top 0.254: R4.2 72.54,24.99 72.54,10.36 68.28,6.1 67.46,6.1 X2.6
N$14
  Bottom 0.254: IC1.6 46.53,35.76 62.18,35.76 65.02,32.92 R9.1
N$15
  Top 0.254: IC1.7 46.53,38.41 52.43,38.41 57.91,32.92 R10.1
N$16
  Bottom 0.254: R9.2 65.02,9.96 64.62,9.55 64.62,6.3 X2.7
N$17
  Bottom 0.254: R10.2 57.91,13.41 61.77,9.55 61.77,6.3 X2.8
N$18
  Top 0.254: R12.1 4.67,54.46 4.67,61.16 TX2.A
N$19
  Top 0.254: R11.1 TX1.A
N$20
  Top 0.254: 88.39,14.02 91.64,10.77 92.05,10.77 | 88.39,14.02 87.17,15.24 R15.1 | 88.39,14.02 91.85,17.48 C3.1 | 92.05,10.77 R16.2 | 92.05,10.77 X3.1
N$21
  Top 0.254: R13.1 30.07,53.65 30.07,61.16 RX1.A
N$22
  Top 0.254: R14.1 12.8,54.46 12.8,61.16 RX2.A
N$23
  Top 0.254: T1.2 123.75,26.21 123.75,26.82 125.37,28.45 125.37,31.7 R17.1
N$24
  Top 0.254: T2.2 151.38,25.2 151.38,29.67 152.81,31.09 R18.1
N$25
  Top 0.254: T3.2 114.4,27.64 114.4,31.7 R19.1
N$26
  Top 0.254: T4.2 141.63,26.62 141.63,31.09 R20.1
N$27
  Bottom 0.254: 103.43,36.17 100.58,36.17 D2.A | 103.43,36.17 104.85,36.17 106.68,38 106.68,42.88 109.93,46.13 K2.8 | 103.43,36.17 97.33,42.27 96.93,42.27 T6.1
N$28
  Top 0.254: K3.8 147.93,46.13 144.68,42.88 144.68,38.81 142.04,36.17 138.79,36.17 D3.A 138.38,36.37 138.38,38.61 134.93,42.06 T7.1
N$29
  Top 0.254: K2.5 110.13,38.61 111.76,40.23 111.76,45.92 109.73,47.95 95.5,47.95 86.36,57.1 84.94,57.1 S3.1
N$30
  Top 0.254: R24.A 80.67,62.99 83.92,59.74 84.73,59.74 S3.2
N$31
  Top 0.254: R22.1 91.85,37.59 94.69,40.44 94.69,41.05 T6.2
N$32
  Top 0.254: K1.8 74.78,46.13 71.53,42.88 71.53,38.81 68.89,36.17 65.63,36.17 D1.A 65.23,36.37 65.23,38.61 61.77,42.06 T5.1
N$33
  Top 0.254: T5.2 59.74,41.05 56.49,44.3 56.49,45.72 R21.1
N$34
  Top 0.254: R23.1 129.64,37.39 133.1,40.84 T7.2
N$37
  Top 0.254: 61.16,62.99 R24.E | R25.2 61.16,62.99 | 61.16,62.99 64.41,59.74 64.41,57.91 R24.S
N$40
  Bottom 0.254: K1.6 74.98,41.25 77.22,43.48 95.5,43.48 96.11,44.09 104.44,44.09 104.85,43.69 K2.2
PHONES_LEFT  (via drill 0.61)
  Top 0.254: v122.94,49.58 134.11,60.76 145.9,60.76 X4.5
  Bottom 0.254: 67.06,43.89 69.7,41.25 K1.3 | 67.06,43.89 65.02,43.89 57.1,51.82 57.1,55.07 56.9,55.27 R25.1 | v122.94,49.58 86.16,49.58 84.53,47.95 70.1,47.95 67.06,44.91 67.06,43.89
PHONES_LEFT_R1  (via drill 0.61)
  Top 0.254: v73.97,39.62 77.42,39.62 105.26,11.79 108.92,11.79 109.73,10.97 113.59,10.97 RIG1.2
  Bottom 0.254: v73.97,39.62 69.9,43.69 K1.2
PHONES_LEFT_R2  (via drill 0.61)
  Top 0.254: v123.95,28.25 123.55,28.25 114.81,36.98 106.68,36.98 105.05,38.61 K2.4
  Bottom 0.254: K1.4 71.73,38.61 74.37,35.97 87.38,35.97 94.28,42.88 95.71,42.88 96.32,43.48 100.18,43.48 105.05,38.61 K2.4 | v123.95,28.25 125.17,27.03 125.17,25.81 140.21,10.77 144.88,10.77 RIG2.2
PHONES_RIGHT  (via drill 0.61)
  Top 0.254: K2.3 105.05,41.25 109.93,41.25 K2.6 | v130.66,41.25 140.61,51.21 150.37,51.21 155.65,56.49 X4.2
  Bottom 0.254: v130.66,41.25 110.13,41.25 K2.6
PHONES_RIGHT_R1
  Top 0.254: K1.7 74.98,43.69 83.72,34.95 83.72,34.14 104.85,13.01 110.34,13.01 RIG1.3
PHONES_RIGHT_R2
  Top 0.254: K1.5 75.64,38.1 103.07,11.18 108.71,11.18 109.53,10.36 121.31,10.36 123.55,12.6 141.63,12.6 RIG2.3
PTT-R1
  Top 0.254: 124.36,24.79 127.41,24.79 C6.1 | 124.36,24.79 121.72,24.79 T1.1 | 124.36,24.79 124.36,21.74 RIG1.4
PTT-R2
  Top 0.254: RIG2.4 149.35,17.07 | 149.35,17.07 T2.1 | 149.35,17.07 156.06,23.77 C7.1
RESET
  Top 0.254: SV1.3 3.86,34.34 18.9,34.34 SV2.3

### Text on the board
tPlace: OTRSP SO2Rduino V1.15 NI2O 04/2011 | http://www.enicomms.com | ENIcommunications Corp | Arduino Nano